# EAGLE schematic alarm clock (EAGLE 7.2.0)
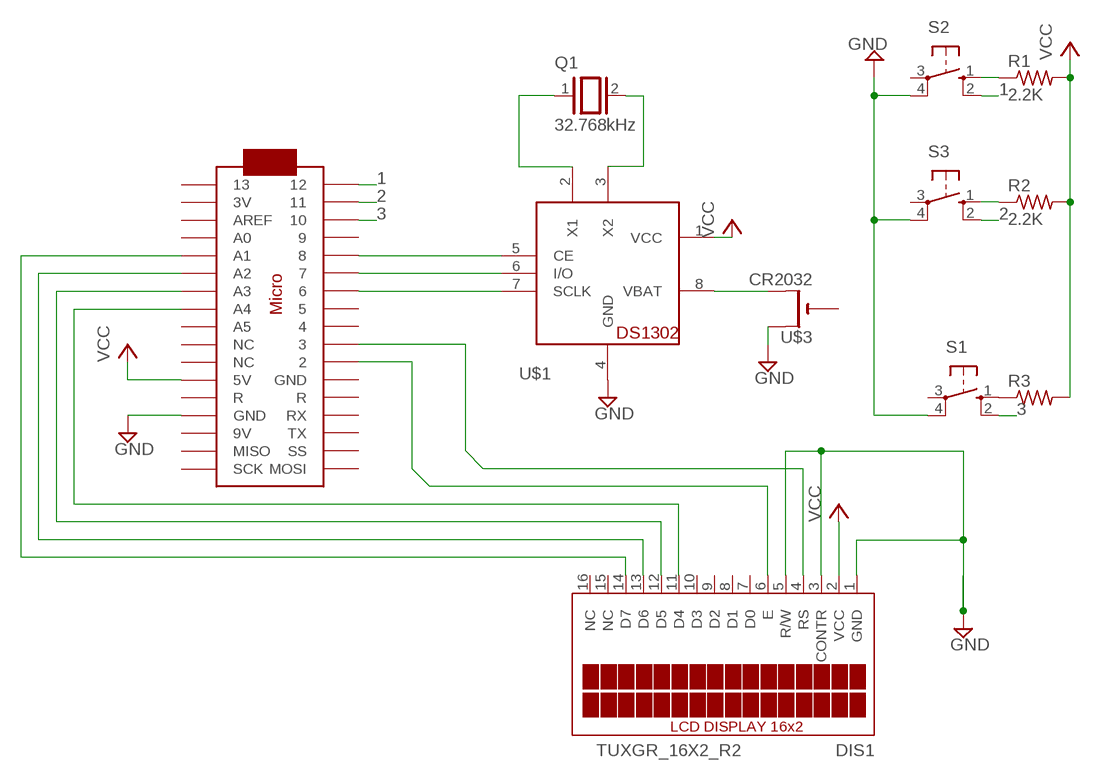
[diagram p0: schematic, sheet 1]

## Parts
DIS1  TUXGR_16X2_R2  [TUXGR_16X2_R2]
Q1  32.768kHz  XTAL  [Q]
R1  2.2K  R-US_0204/7  [0204/7]
R2  2.2K  R-US_0204/7  [0204/7]
R3  R-US_0204/7  [0204/7]
S1  40-XX  [B3F-40XX]
S2  40-XX  [B3F-40XX]
S3  40-XX  [B3F-40XX]
U$1  DS1302  [DIL08-ROUND]
U$2  ARDUINOMICRO  [ARDUINOMICRO]
U$3  CR2032  CR2032SMT  [CR2032-SMD]

## Nets
1: S2.2(S1) U$2.P$1
2: S3.2(S1) U$2.P$2
3: S1.2(S1) U$2.P$3
GND: DIS1.1(GND) DIS1.3(CONTR) DIS1.5(R/W) S1.4(P1) S2.4(P1) S3.4(P1) U$1.4(GND) U$2.P$12(GND) U$3.+$1(+)
N$1: U$1.7(SCLK) U$2.P$7
N$2: U$1.6(I/O) U$2.P$6
N$3: U$1.5(CE) U$2.P$5
N$4: Q1.2 U$1.3(X2)
N$5: Q1.1 U$1.2(X1)
N$6: U$1.8(VBAT) U$3.+$2(+1)
N$7: DIS1.6(E) U$2.P$11
N$8: DIS1.4(RS) U$2.P$10
N$10: DIS1.14(D7) U$2.P$30(A1)
N$11: DIS1.13(D6) U$2.P$29(A2)
N$12: DIS1.12(D5) U$2.P$28(A3)
N$13: DIS1.11(D4) U$2.P$27(A4)
N$14: R3.1 S1.1(S)
N$15: R2.1 S3.1(S)
N$16: R1.1 S2.1(S)
VCC: DIS1.2(VCC) R1.2 R2.2 R3.2 U$1.1(VCC) U$2.P$23(5V)
Unconnected: DIS1.7(D0) DIS1.8(D1) DIS1.9(D2) DIS1.10(D3) DIS1.15(NC) DIS1.16(NC) S1.3(P) S2.3(P) S3.3(P) U$2.P$4 U$2.P$8 U$2.P$9 U$2.P$13(R) U$2.P$14(RX) U$2.P$15(TX) U$2.P$16(SS) U$2.P$17(MOSI) U$2.P$18(SCK) U$2.P$19(MISO) U$2.P$20(9V) U$2.P$21(GND) U$2.P$22(R) U$2.P$24(NC) U$2.P$25(NC) U$2.P$26(A5) U$2.P$31(A0) U$2.P$32(AREF) U$2.P$33(3V) U$2.P$34 U$3.-

## Library data of the parts
DIS1 = display-lcd:TUXGR_16X2_R2: Tuxgraphics LCD display 16x2 characters reflective, without background light Source: tuxgr_12x2_r2.pdf; OC_FARNELL: unknown; OC_NEWARK: unknown
Q1 = special:XTAL: CRYSTAL
R1-R3 = rcl:R-US_: RESISTOR, American symbol
S1-S3 = adafruit:40-XX: OMRON SWITCH; MF: OMRON COMPONENTS USA; MPN: B3F-4000; OC_FARNELL: 176434; OC_NEWARK: 36K3105
U$1 = adafruit:DS1302: DS1302 - Real time clock with supercap trickle charger
U$2 = adafruit:ARDUINOMICRO
U$3 = adafruit:CR2032